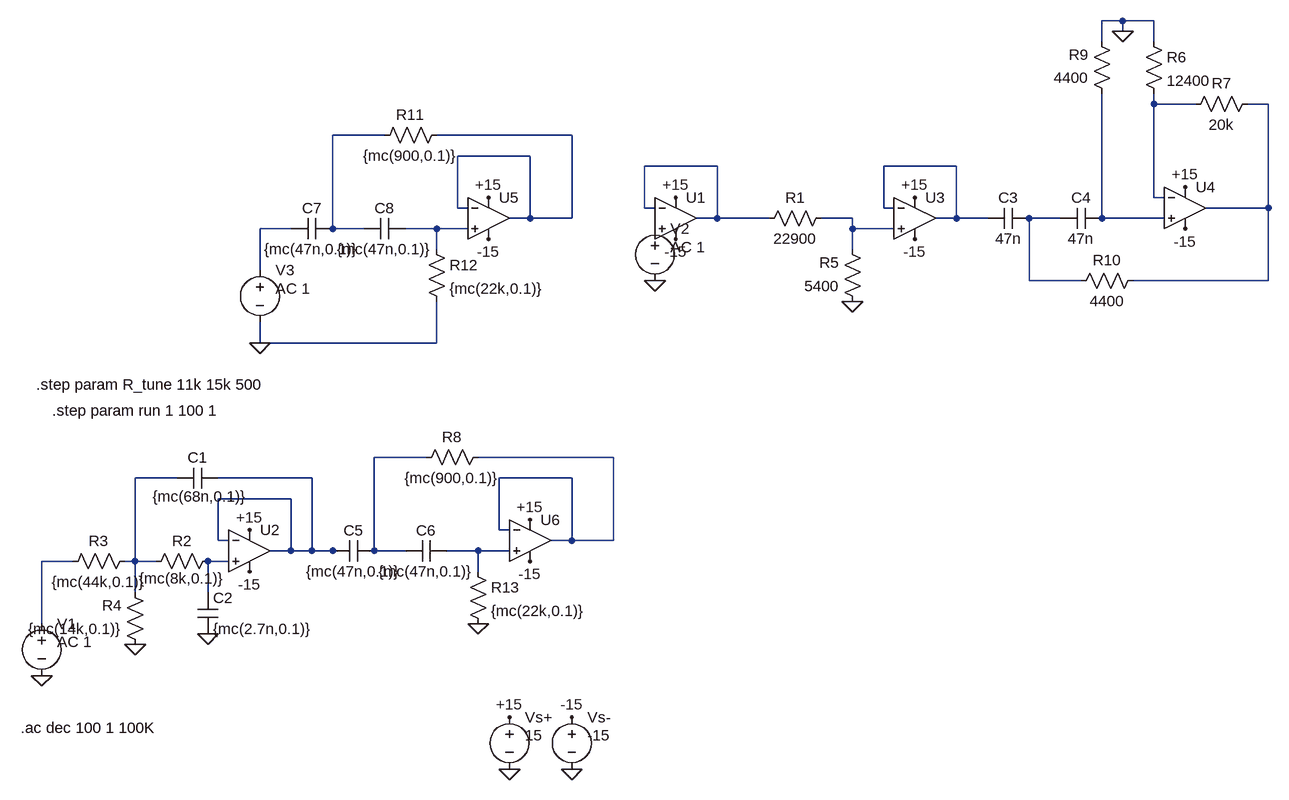
[diagram p0: schematic TP4.asc]
TP4.asc, the LTspice schematic file:
Version 4.1
SHEET 1 1832 680
WIRE 1600 -720 1568 -720
WIRE 1648 -720 1600 -720
WIRE 1600 -704 1600 -720
WIRE 1568 -688 1568 -720
WIRE 1648 -688 1648 -720
WIRE 1648 -592 1648 -608
WIRE 1712 -592 1648 -592
WIRE 1824 -592 1792 -592
WIRE 464 -544 384 -544
WIRE 752 -544 544 -544
WIRE 688 -512 576 -512
WIRE 976 -496 864 -496
WIRE 1344 -496 1232 -496
WIRE 1648 -448 1648 -592
WIRE 1664 -448 1648 -448
WIRE 576 -432 576 -512
WIRE 592 -432 576 -432
WIRE 864 -432 864 -496
WIRE 880 -432 864 -432
WIRE 1232 -432 1232 -496
WIRE 1248 -432 1232 -432
WIRE 1824 -432 1824 -592
WIRE 1824 -432 1728 -432
WIRE 688 -416 688 -512
WIRE 688 -416 656 -416
WIRE 752 -416 752 -544
WIRE 752 -416 688 -416
WIRE 976 -416 976 -496
WIRE 976 -416 944 -416
WIRE 1056 -416 976 -416
WIRE 1184 -416 1136 -416
WIRE 1344 -416 1344 -496
WIRE 1344 -416 1312 -416
WIRE 1392 -416 1344 -416
WIRE 1504 -416 1456 -416
WIRE 1568 -416 1568 -608
WIRE 1664 -416 1568 -416
WIRE 320 -400 272 -400
WIRE 384 -400 384 -544
WIRE 432 -400 384 -400
WIRE 544 -400 496 -400
WIRE 592 -400 544 -400
WIRE 1184 -400 1184 -416
WIRE 1248 -400 1184 -400
WIRE 544 -368 544 -400
WIRE 1184 -368 1184 -400
WIRE 272 -336 272 -400
WIRE 1456 -320 1456 -416
WIRE 1536 -320 1456 -320
WIRE 1824 -320 1824 -432
WIRE 1824 -320 1616 -320
WIRE 272 -224 272 -256
WIRE 544 -224 544 -288
WIRE 544 -224 272 -224
WIRE 528 -48 448 -48
WIRE 816 -48 608 -48
WIRE 144 -16 80 -16
WIRE 352 -16 208 -16
WIRE 752 -16 640 -16
WIRE 320 16 208 16
WIRE 640 64 640 -16
WIRE 656 64 640 64
WIRE 208 80 208 16
WIRE 224 80 208 80
WIRE 752 80 752 -16
WIRE 752 80 720 80
WIRE 816 80 816 -48
WIRE 816 80 752 80
WIRE 320 96 320 16
WIRE 320 96 288 96
WIRE 352 96 352 -16
WIRE 352 96 320 96
WIRE 384 96 352 96
WIRE 400 96 384 96
WIRE 448 96 448 -48
WIRE 496 96 448 96
WIRE 608 96 560 96
WIRE 656 96 608 96
WIRE -16 112 -64 112
WIRE 80 112 80 -16
WIRE 80 112 64 112
WIRE 112 112 80 112
WIRE 224 112 192 112
WIRE 608 128 608 96
WIRE 80 160 80 112
WIRE 192 160 192 112
WIRE -64 208 -64 112
FLAG 80 240 0
FLAG -64 288 0
FLAG 192 224 0
FLAG 656 432 0
FLAG 752 432 0
FLAG 256 64 +15
FLAG 656 352 +15
FLAG 256 128 -15
FLAG 752 352 -15
FLAG 912 -448 +15
FLAG 912 -384 -15
FLAG 1280 -448 +15
FLAG 1280 -384 -15
FLAG 1696 -464 +15
FLAG 1696 -400 -15
FLAG 1600 -704 0
FLAG 1184 -288 0
FLAG 624 -448 +15
FLAG 624 -384 -15
FLAG 272 -224 0
FLAG 688 48 +15
FLAG 688 112 -15
FLAG 880 -320 0
FLAG 608 208 0
SYMBOL voltage -64 192 R0
WINDOW 3 24 152 Left 2
WINDOW 123 24 44 Left 2
WINDOW 39 0 0 Left 0
SYMATTR Value ""
SYMATTR Value2 AC 1
SYMATTR InstName V1
SYMBOL res 80 96 R90
WINDOW 0 0 56 VBottom 2
WINDOW 3 32 56 VTop 2
SYMATTR InstName R3
SYMATTR Value {mc(44k,0.1)}
SYMBOL res 96 256 R180
WINDOW 0 36 76 Left 2
WINDOW 3 36 40 Left 2
SYMATTR InstName R4
SYMATTR Value {mc(14k,0.1)}
SYMBOL cap 208 -32 R90
WINDOW 0 0 32 VBottom 2
WINDOW 3 60 28 VBottom 2
SYMATTR InstName C1
SYMATTR Value {mc(68n,0.1)}
SYMBOL res 208 96 R90
WINDOW 0 0 56 VBottom 2
WINDOW 3 58 56 VBottom 2
SYMATTR InstName R2
SYMATTR Value {mc(8k,0.1)}
SYMBOL cap 176 160 R0
SYMATTR InstName C2
SYMATTR Value {mc(2.7n,0.1)}
SYMBOL OpAmps\\UniversalOpAmp2 256 96 R0
SYMATTR InstName U2
SYMBOL voltage 656 336 R0
WINDOW 3 24 44 Left 2
WINDOW 123 0 0 Left 0
WINDOW 39 0 0 Left 0
SYMATTR Value 15
SYMATTR InstName Vs+
SYMBOL voltage 752 336 R0
WINDOW 3 24 44 Left 2
WINDOW 123 0 0 Left 0
WINDOW 39 0 0 Left 0
SYMATTR Value -15
SYMATTR InstName Vs-
SYMBOL OpAmps\\UniversalOpAmp2 912 -416 R0
SYMATTR InstName U1
SYMBOL OpAmps\\UniversalOpAmp2 1280 -416 R0
SYMATTR InstName U3
SYMBOL OpAmps\\UniversalOpAmp2 1696 -432 R0
SYMATTR InstName U4
SYMBOL res 1152 -432 R90
WINDOW 0 0 56 VBottom 2
WINDOW 3 32 56 VTop 2
SYMATTR InstName R1
SYMATTR Value 22900
SYMBOL res 1200 -272 R180
WINDOW 0 36 76 Left 2
WINDOW 3 36 40 Left 2
SYMATTR InstName R5
SYMATTR Value 5400
SYMBOL res 1632 -704 R0
SYMATTR InstName R6
SYMATTR Value 12400
SYMBOL res 1808 -608 R90
WINDOW 0 0 56 VBottom 2
WINDOW 3 32 56 VTop 2
SYMATTR InstName R7
SYMATTR Value 20k
SYMBOL res 1584 -592 R180
WINDOW 0 36 76 Left 2
WINDOW 3 36 40 Left 2
SYMATTR InstName R9
SYMATTR Value 4400
SYMBOL res 1632 -336 R90
WINDOW 0 0 56 VBottom 2
WINDOW 3 32 56 VTop 2
SYMATTR InstName R10
SYMATTR Value 4400
SYMBOL cap 1456 -432 R90
WINDOW 0 0 32 VBottom 2
WINDOW 3 32 32 VTop 2
SYMATTR InstName C3
SYMATTR Value 47n
SYMBOL cap 1568 -432 R90
WINDOW 0 0 32 VBottom 2
WINDOW 3 32 32 VTop 2
SYMATTR InstName C4
SYMATTR Value 47n
SYMBOL OpAmps\\UniversalOpAmp2 624 -416 R0
SYMATTR InstName U5
SYMBOL res 560 -560 R90
WINDOW 0 0 56 VBottom 2
WINDOW 3 32 56 VTop 2
SYMATTR InstName R11
SYMATTR Value {mc(900,0.1)}
SYMBOL cap 384 -416 R90
WINDOW 0 0 32 VBottom 2
WINDOW 3 32 32 VTop 2
SYMATTR InstName C7
SYMATTR Value {mc(47n,0.1)}
SYMBOL cap 496 -416 R90
WINDOW 0 0 32 VBottom 2
WINDOW 3 32 32 VTop 2
SYMATTR InstName C8
SYMATTR Value {mc(47n,0.1)}
SYMBOL voltage 272 -352 R0
WINDOW 3 24 152 Left 2
WINDOW 123 24 44 Left 2
WINDOW 39 0 0 Left 0
SYMATTR Value ""
SYMATTR Value2 AC 1
SYMATTR InstName V3
SYMBOL res 528 -384 R0
SYMATTR InstName R12
SYMATTR Value {mc(22k,0.1)}
SYMBOL OpAmps\\UniversalOpAmp2 688 80 R0
SYMATTR InstName U6
SYMBOL res 624 -64 R90
WINDOW 0 0 56 VBottom 2
WINDOW 3 32 56 VTop 2
SYMATTR InstName R8
SYMATTR Value {mc(900,0.1)}
SYMBOL cap 448 80 R90
WINDOW 0 0 32 VBottom 2
WINDOW 3 32 32 VTop 2
SYMATTR InstName C5
SYMATTR Value {mc(47n,0.1)}
SYMBOL cap 560 80 R90
WINDOW 0 0 32 VBottom 2
WINDOW 3 32 32 VTop 2
SYMATTR InstName C6
SYMATTR Value {mc(47n,0.1)}
SYMBOL res 592 112 R0
SYMATTR InstName R13
SYMATTR Value {mc(22k,0.1)}
SYMBOL voltage 880 -416 R0
WINDOW 3 24 152 Left 2
WINDOW 123 24 44 Left 2
WINDOW 39 0 0 Left 0
SYMATTR Value ""
SYMATTR Value2 AC 1
SYMATTR InstName V2
TEXT -96 368 Left 2 !.ac dec 100 1 100K
TEXT -72 -160 Left 2 !.step param R_tune 11k 15k 500
TEXT -48 -120 Left 2 !.step param run 1 100 1

The netlist it stands for:
* TP4.asc
V1 N017 0 AC 1
R3 N014 N017 {mc(44k,0.1)}
R4 0 N014 {mc(14k,0.1)}
C1 N015 N014 {mc(68n,0.1)}
R2 N018 N014 {mc(8k,0.1)}
C2 N018 0 {mc(2.7n,0.1)}
X§U2 N018 N015 +15 -15 N015 level2 Avol=1Meg GBW=10Meg Slew=10Meg Ilimit=25m Rail=0 Vos=0 En=0 Enk=0 In=0 Ink=0 Rin=500Meg  ; pins In+ In- V+ V- OUT
Vs+ +15 0 15
Vs- -15 0 -15
X§U1 P001 N005 +15 -15 N005 level2 Avol=1Meg GBW=10Meg Slew=10Meg Ilimit=25m Rail=0 Vos=0 En=0 Enk=0 In=0 Ink=0 Rin=500Meg  ; pins In+ In- V+ V- OUT
X§U3 N007 N006 +15 -15 N006 level2 Avol=1Meg GBW=10Meg Slew=10Meg Ilimit=25m Rail=0 Vos=0 En=0 Enk=0 In=0 Ink=0 Rin=500Meg  ; pins In+ In- V+ V- OUT
X§U4 N009 N001 +15 -15 N002 level2 Avol=1Meg GBW=10Meg Slew=10Meg Ilimit=25m Rail=0 Vos=0 En=0 Enk=0 In=0 Ink=0 Rin=500Meg  ; pins In+ In- V+ V- OUT
R1 N007 N005 22900
R5 0 N007 5400
R6 0 N001 12400
R7 N002 N001 20k
R9 N009 0 4400
R10 N002 N008 4400
C3 N008 N006 47n
C4 N009 N008 47n
X§U5 N011 N004 +15 -15 N004 level2 Avol=1Meg GBW=10Meg Slew=10Meg Ilimit=25m Rail=0 Vos=0 En=0 Enk=0 In=0 Ink=0 Rin=500Meg  ; pins In+ In- V+ V- OUT
R11 N004 N003 {mc(900,0.1)}
C7 N003 N010 {mc(47n,0.1)}
C8 N011 N003 {mc(47n,0.1)}
V3 N010 0 AC 1
R12 N011 0 {mc(22k,0.1)}
X§U6 N016 N013 +15 -15 N013 level2 Avol=1Meg GBW=10Meg Slew=10Meg Ilimit=25m Rail=0 Vos=0 En=0 Enk=0 In=0 Ink=0 Rin=500Meg  ; pins In+ In- V+ V- OUT
R8 N013 N012 {mc(900,0.1)}
C5 N012 N015 {mc(47n,0.1)}
C6 N016 N012 {mc(47n,0.1)}
R13 N016 0 {mc(22k,0.1)}
V2 P001 0 AC 1
.ac dec 100 1 100K
.step param R_tune 11k 15k 500
.step param run 1 100 1
.lib UniversalOpAmp2.lib
.backanno
.end